# Altium schematic sheet labproject_1_pcb.schdoc
size 297 x 200 mm
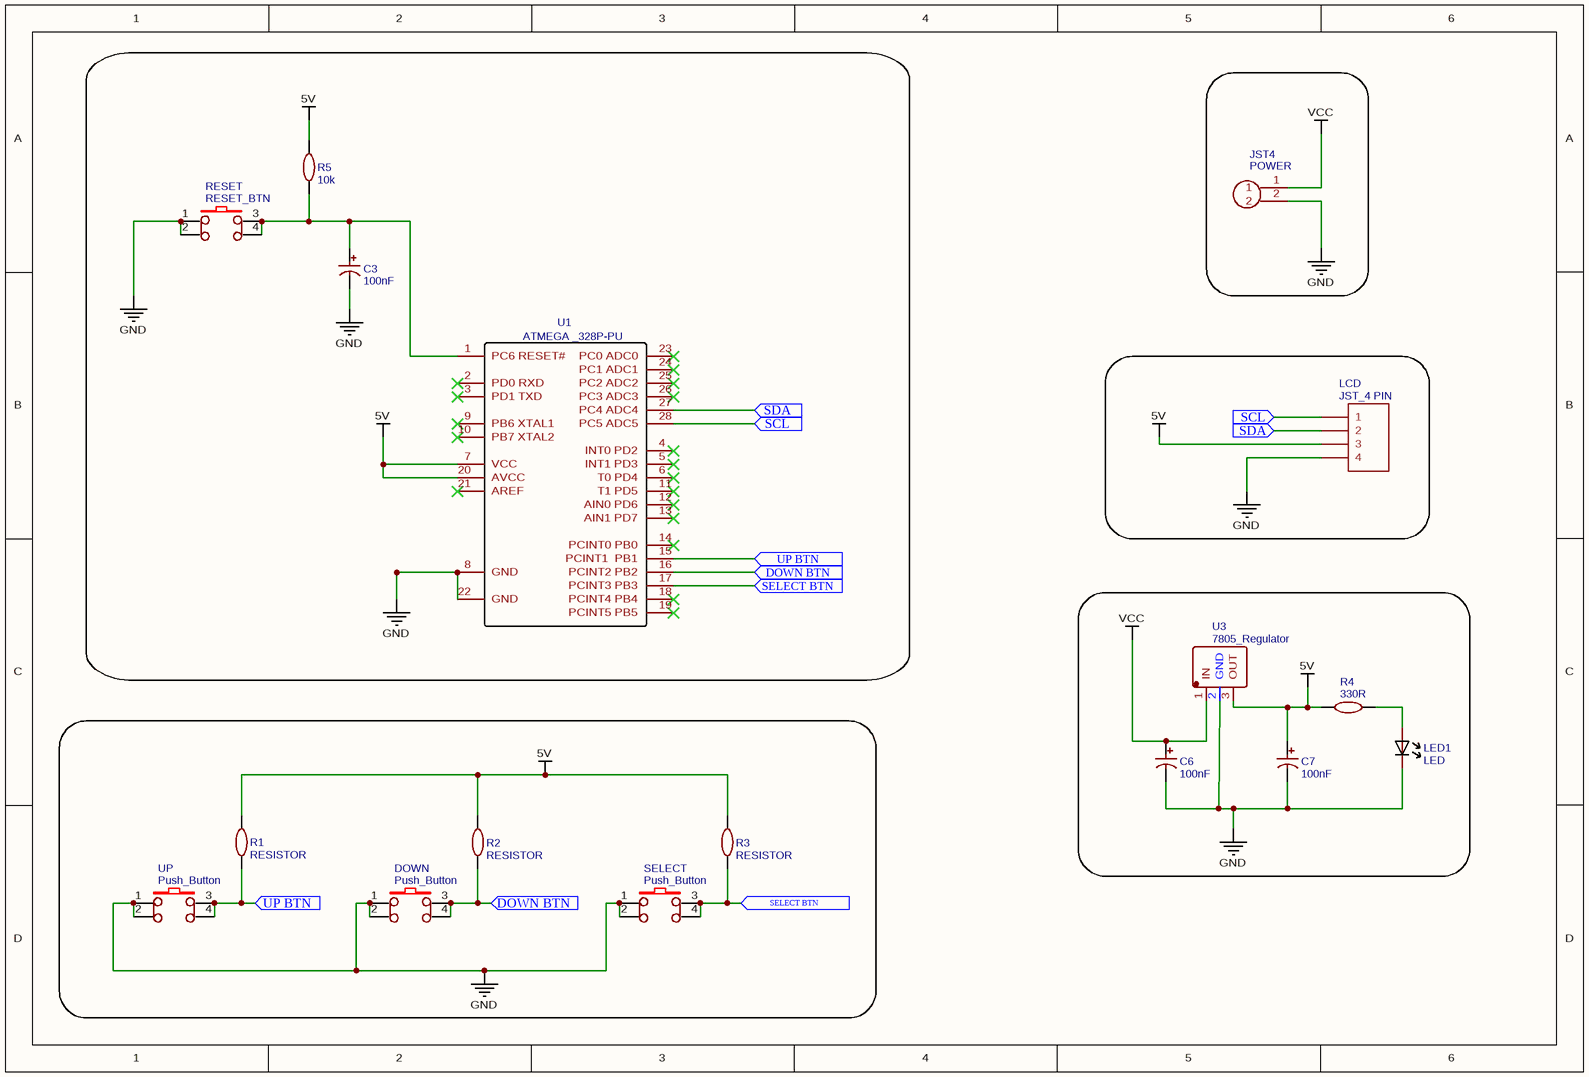
[diagram p0: labproject_1_pcb.schdoc]

## Parts
C3  100nF  [CAP-TH_BD5.0-P2.00-D0.8-FD]
C6  100nF  [CAP-TH_BD5.0-P2.00-D0.8-FD]
C7  100nF  [CAP-TH_BD5.0-P2.00-D0.8-FD]
DOWN  Push_Button  [KEY-TH_4P-L6.0-W6.0-P4.50]
JST4  POWER  [CONN-TH_XHB-2A]
LCD  JST_4 PIN  [JST_XH_4_PIN_TOP_ENTRY]
LED1  LED  [5MM LED]
R1  RESISTOR  [AXIAL-0.4]
R2  RESISTOR  [AXIAL-0.4]
R3  RESISTOR  [AXIAL-0.4]
R4  330R  [AXIAL-0.4]
R5  10k  [AXIAL-0.4]
RESET  RESET_BTN  [KEY-TH_4P-L6.0-W6.0-P4.50]
SELECT  Push_Button  [KEY-TH_4P-L6.0-W6.0-P4.50]
U1  ATMEGA _328P-PU  [DIP-28_L34.6-W7.3-P2.54-LS10.2-BL]
U3  7805_Regulator  [TO-220-3_L10.0-W4.5-P2.54-L]
UP  Push_Button  [KEY-TH_4P-L6.0-W6.0-P4.50]

## Ports
DOWN BTN (in), SCL (in), SDA (in), SELECT BTN (in), UP BTN (in)

## Nets
5V: C7.1 LCD.3 R1.2 R2.2 R3.2 R4.1 R5.2 U1.7(VCC) U1.20(AVCC) U3.3(OUT)
GND: C3.2 C6.2 C7.2 DOWN.1 DOWN.2 JST4.2 LCD.4 LED1.2 RESET.1 RESET.2 SELECT.1 SELECT.2 U1.8(GND) U1.22(GND) U3.2(GND) UP.1 UP.2
VCC: C6.1 JST4.1 U3.1(IN)
DOWN BTN: DOWN.3 DOWN.4 R2.1 U1.16(PCINT2_PB2) ; port DOWN BTN
SCL: LCD.1 U1.28(PC5_ADC5) ; port SCL
SDA: LCD.2 U1.27(PC4_ADC4) ; port SDA
SELECT BTN: R3.1 SELECT.3 SELECT.4 U1.17(PCINT3_PB3) ; port SELECT BTN
UP BTN: R1.1 U1.15(PCINT1__PB1) UP.3 UP.4 ; port UP BTN
NetC3_1: C3.1 R5.1 RESET.3 RESET.4 U1.1(PC6_RESET#)
NetLED1_1: LED1.1 R4.2

Not connected (* = marked no-connect by the designer): U1 2(PD0_RXD)* 3(PD1_TXD)* 4(INT0_PD2)* 5(INT1_PD3)* 6(T0_PD4)* 9(PB6_XTAL1)* 10(PB7_XTAL2)* 11(T1_PD5)* 12(AIN0_PD6)* 13(AIN1_PD7)* 14(PCINT0_PB0)* 18(PCINT4_PB4)* 19(PCINT5_PB5)* 21(AREF)* 23(PC0_ADC0)* 24(PC1_ADC1)* 25(PC2_ADC2)* 26(PC3_ADC3)*

## Library data of the parts
C3 C6 C7 = 100nF: BOM_Manufacturer: ValuePro; BOM_Manufacturer Part: 0.1UF 50V; nameAlias: Capacitance; BOM_Supplier: LCSC; BOM_Supplier Part: C28061; BOM_JLCPCB Part Class: Extended Part; spicePre: C; spiceSymbolName: 0.1uF
DOWN SELECT UP = Push_Button: BOM_Manufacturer: ReliaPro; BOM_Manufacturer Part: button6*6*8.5; BOM_Supplier Part: C59980; BOM_Supplier: LCSC; image: http://image.lceda.cn/szlcsc/C59980.jpg; spicePre: K; spiceSymbolName: Push_Button
JST4 = POWER: BOM_Manufacturer: BOOMELE; BOM_Manufacturer Part: XHB-2A Connector; BOM_Supplier: LCSC; image: //image.lceda.cn/szlcsc/C57981.jpg; BOM_Supplier Part: C57981; BOM_JLCPCB Part Class: Extended Part; spicePre: C; spiceSymbolName: JST_2 PIN
LCD = JST_4 PIN: Contributor: fabiano.riccardi; spicePre: J; spiceSymbolName: JST_4 PIN
LED1 = LED: Contributor: Axbri; BOM_Manufacturer Part: 5mm LED; spicePre: U; spiceSymbolName: LED
R1-R3 = RESISTOR: BOM_Manufacturer: UniOhm; BOM_Manufacturer Part: MFR0W4F2200A50; Power: 1/4W; Tolerance: ±1%; BOM_EasyEDA: E57439; Value: Value; BOM_Supplier Part: E57439; BOM_Supplier: EasyEDA; spicePre: R; spiceSymbolName: RESISTOR
R4 = 330R: BOM_Manufacturer: UniOhm; BOM_Manufacturer Part: MFR0W4F2200A50; Power: 1/4W; Tolerance: ±1%; BOM_EasyEDA: E57439; Value: Value; BOM_Supplier Part: E57439; BOM_Supplier: EasyEDA; spicePre: R; spiceSymbolName: RESISTOR
R5 = 10k: BOM_Manufacturer: UniOhm; BOM_Manufacturer Part: MFR0W4F2200A50; Power: 1/4W; Tolerance: ±1%; BOM_EasyEDA: E57439; Value: Value; BOM_Supplier Part: E57439; BOM_Supplier: EasyEDA; spicePre: R; spiceSymbolName: RESISTOR
RESET = RESET_BTN: BOM_Manufacturer: ReliaPro; BOM_Manufacturer Part: button6*6*8.5; BOM_Supplier Part: C59980; BOM_Supplier: LCSC; image: http://image.lceda.cn/szlcsc/C59980.jpg; spicePre: K; spiceSymbolName: Push_Button
U1 = ATMEGA _328P-PU: BOM_Manufacturer: MICROCHIP; BOM_Manufacturer Part: ATMEGA328P-PU; sourceId: Oic6oiASL; Contributor: LCSC; timeStamp: 1451725987; BOM_Supplier: LCSC; image: //image.lceda.cn/szlcsc/C33901.jpg; BOM_Supplier Part: C33901; spicePre: U; spiceSymbolName: ATMEGA _328P-PU
U3 = 7805_Regulator: BOM_Manufacturer: Foshan Blue Rocket Elec; BOM_Manufacturer Part: 7805; Contributor: LCSC; BOM_Supplier: LCSC; BOM_Supplier Part: C305416; BOM_JLCPCB Part Class: Extended Part; spicePre: U; spiceSymbolName: 7805_Regulator